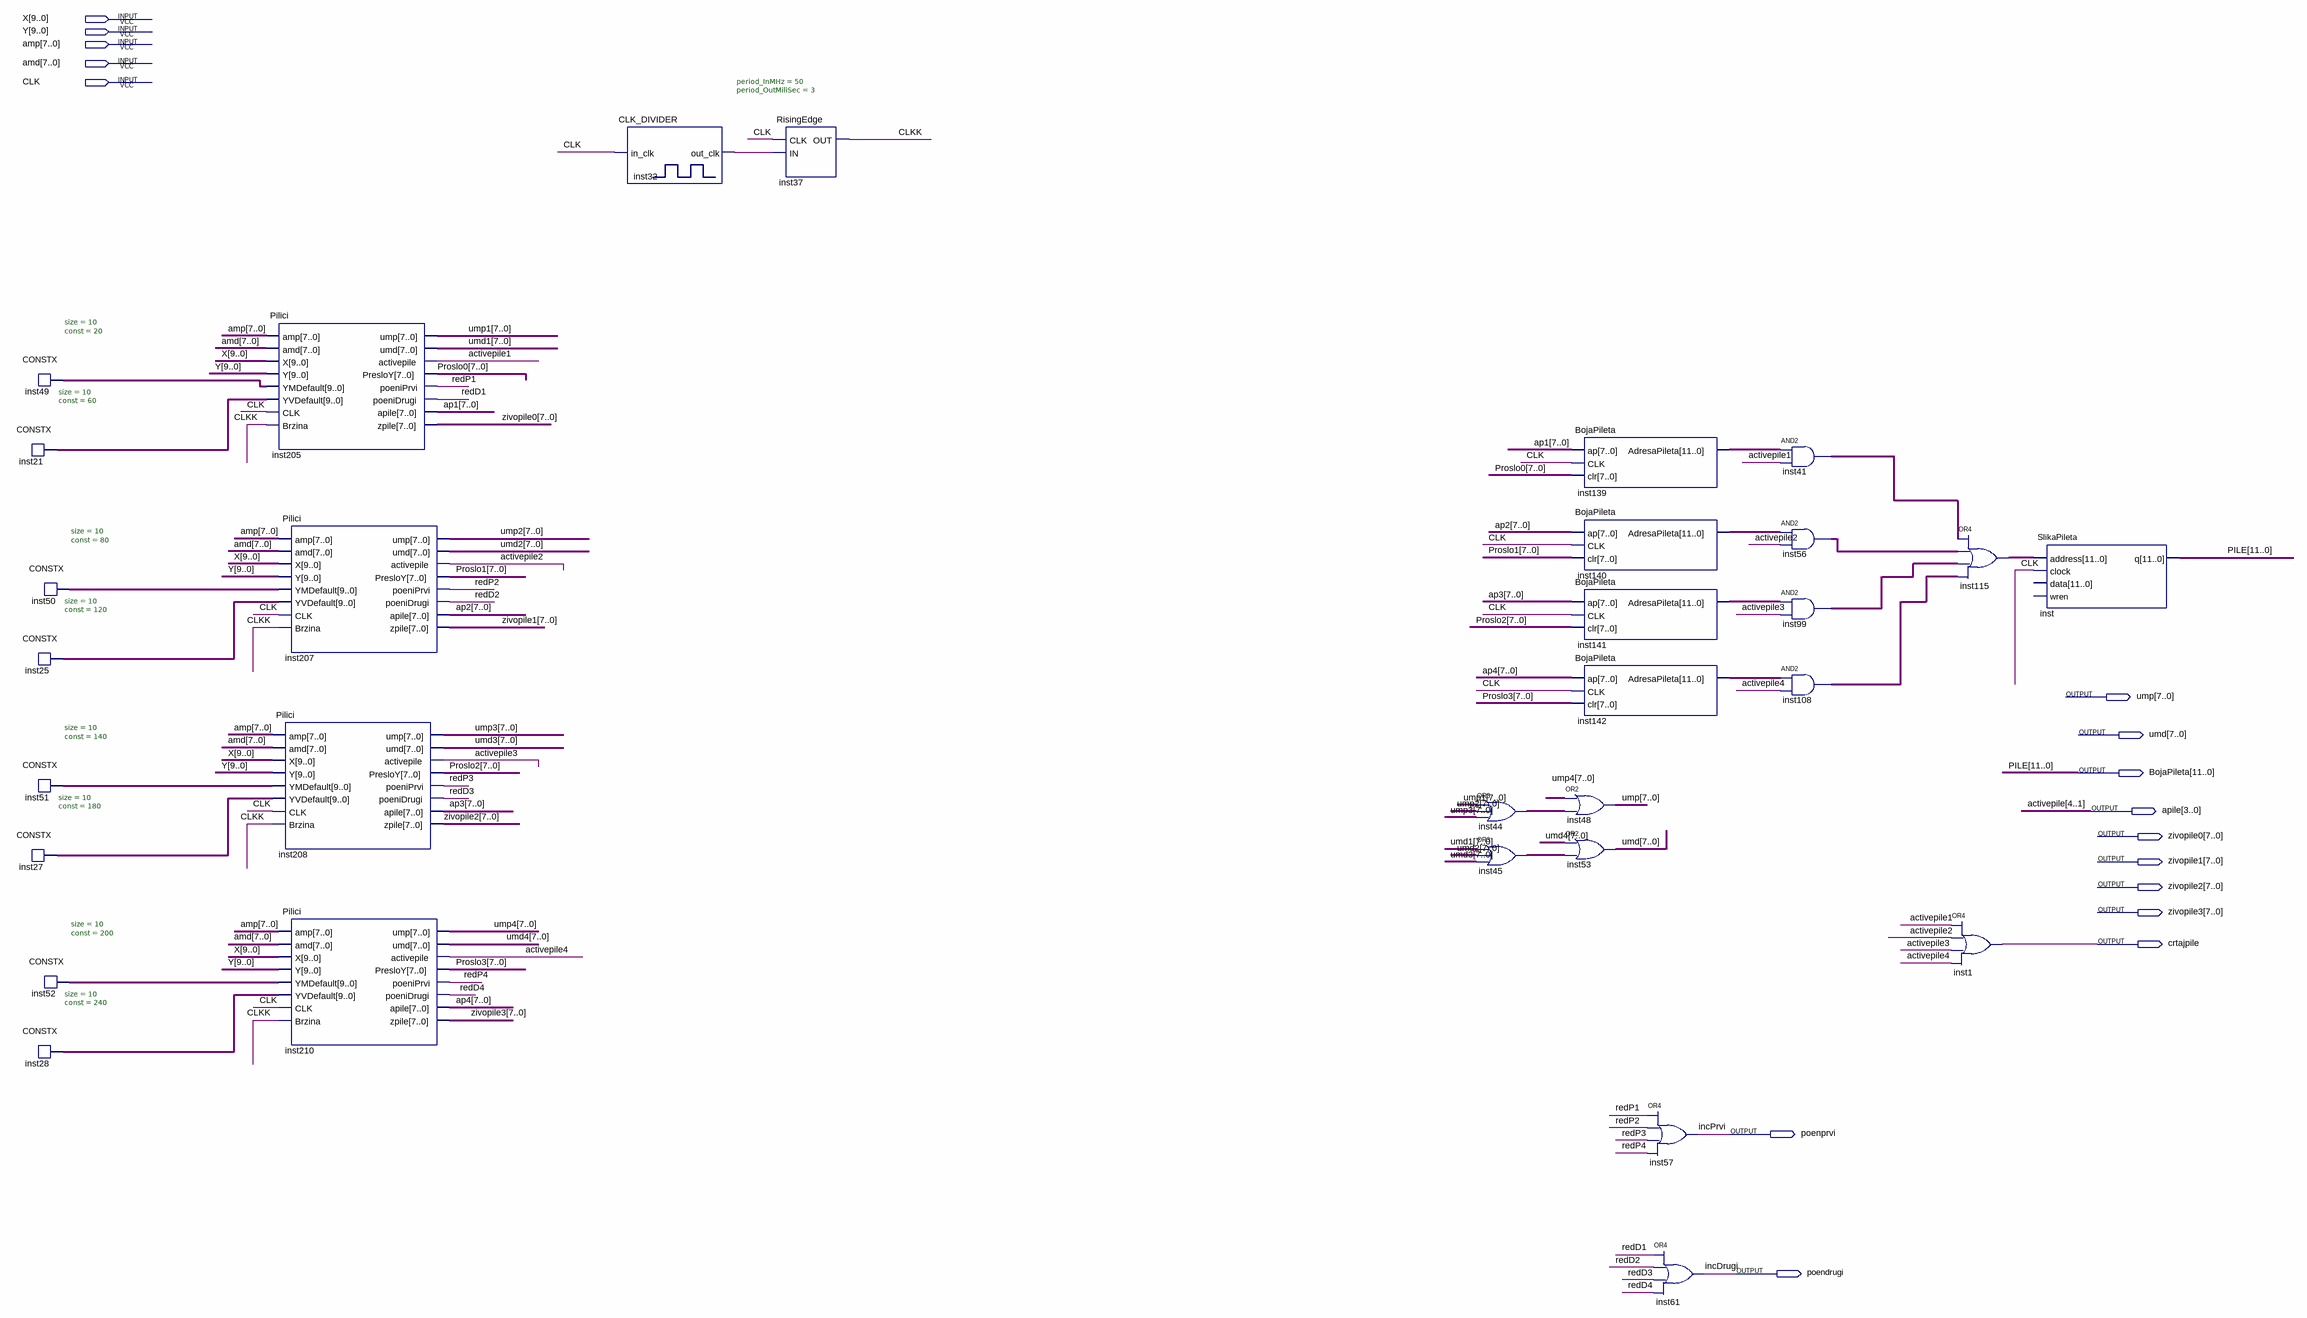
[diagram p0: schematic sheet]
// Quartus schematic Svi_Pilici.bdf as structural Verilog: 31 symbols, 16 pins
module Svi_Pilici (
  input  [9:0] X,
  input  [9:0] Y,
  input  [7:0] amp,
  input  [7:0] amd,
  input  CLK,
  output [7:0] ump,
  output [7:0] umd,
  output [11:0] BojaPileta,
  output [3:0] apile,
  output [7:0] zivopile0,
  output [7:0] zivopile1,
  output [7:0] zivopile2,
  output [7:0] zivopile3,
  output crtajpile,
  output poenprvi,
  output poendrugi
);

  wire CLKK, inst32_out_clk, redD1, redD2, redD3, redD4, redP1, redP2, redP3, redP4;
  wire [7:0] ap1, ap2, ap3, ap4, inst44_out, inst45_out, Proslo0, Proslo1, Proslo2, Proslo3, umd1, umd2,
       umd3, umd4, ump1, ump2, ump3, ump4;
  wire [9:0] inst21_data, inst25_data, inst27_data, inst28_data, inst49_data, inst50_data, inst51_data,
       inst52_data;
  wire [11:0] inst41_out, inst56_out, inst99_out, inst108_out, inst115_out, inst139_adresapileta,
       inst140_adresapileta, inst141_adresapileta, inst142_adresapileta;

  CONSTX #(.size(10), .\const (20)) inst49 (.data(inst49_data));
  CONSTX #(.size(10), .\const (60)) inst21 (.data(inst21_data));
  CONSTX #(.size(10), .\const (80)) inst50 (.data(inst50_data));
  CONSTX #(.size(10), .\const (120)) inst25 (.data(inst25_data));
  CONSTX #(.size(10), .\const (140)) inst51 (.data(inst51_data));
  CONSTX #(.size(10), .\const (180)) inst27 (.data(inst27_data));
  CONSTX #(.size(10), .\const (200)) inst52 (.data(inst52_data));
  CONSTX #(.size(10), .\const (240)) inst28 (.data(inst28_data));
  Pilici inst205 (
    .amp(amp), .amd(amd), .X(X), .Y(Y), .YMDefault(inst49_data), .YVDefault(inst21_data), .CLK(CLK),
    .Brzina(CLKK), .ump(ump1), .umd(umd1), .activepile(apile[0]), .PresloY(Proslo0), .poeniPrvi(redP1),
    .poeniDrugi(redD1), .apile(ap1), .zpile(zivopile0));
  Pilici inst207 (
    .amp(amp), .amd(amd), .X(X), .Y(Y), .YMDefault(inst50_data), .YVDefault(inst25_data), .CLK(CLK),
    .Brzina(CLKK), .ump(ump2), .umd(umd2), .activepile(apile[1]), .PresloY(Proslo1), .poeniPrvi(redP2),
    .poeniDrugi(redD2), .apile(ap2), .zpile(zivopile1));
  Pilici inst208 (
    .amp(amp), .amd(amd), .X(X), .Y(Y), .YMDefault(inst51_data), .YVDefault(inst27_data), .CLK(CLK),
    .Brzina(CLKK), .ump(ump3), .umd(umd3), .activepile(apile[2]), .PresloY(Proslo2), .poeniPrvi(redP3),
    .poeniDrugi(redD3), .apile(ap3), .zpile(zivopile2));
  Pilici inst210 (
    .amp(amp), .amd(amd), .X(X), .Y(Y), .YMDefault(inst52_data), .YVDefault(inst28_data), .CLK(CLK),
    .Brzina(CLKK), .ump(ump4), .umd(umd4), .activepile(apile[3]), .PresloY(Proslo3), .poeniPrvi(redP4),
    .poeniDrugi(redD4), .apile(ap4), .zpile(zivopile3));
  CLK_DIVIDER #(.period_InMHz(50), .period_OutMiliSec(3)) inst32 (.in_clk(CLK), .out_clk(inst32_out_clk));
  RisingEdge inst37 (.CLK(CLK), .IN(inst32_out_clk), .OUT(CLKK));
  assign inst44_out = ump1 | ump2 | ump3;  // OR3 inst44, 8 bits wide
  assign inst45_out = umd1 | umd2 | umd3;  // OR3 inst45, 8 bits wide
  BojaPileta inst139 (.ap(ap1), .CLK(CLK), .clr(Proslo0), .AdresaPileta(inst139_adresapileta));
  BojaPileta inst140 (.ap(ap2), .CLK(CLK), .clr(Proslo1), .AdresaPileta(inst140_adresapileta));
  BojaPileta inst141 (.ap(ap3), .CLK(CLK), .clr(Proslo2), .AdresaPileta(inst141_adresapileta));
  BojaPileta inst142 (.ap(ap4), .CLK(CLK), .clr(Proslo3), .AdresaPileta(inst142_adresapileta));
  assign ump = ump4 | inst44_out;  // OR2 inst48, 8 bits wide
  assign umd = umd4 | inst45_out;  // OR2 inst53, 8 bits wide
  or inst57 (poenprvi, redP1, redP2, redP3, redP4);
  or inst61 (poendrugi, redD1, redD2, redD3, redD4);
  assign inst41_out = inst139_adresapileta & {12{apile[0]}};  // AND2 inst41, 12 bits wide
  assign inst56_out = inst140_adresapileta & {12{apile[1]}};  // AND2 inst56, 12 bits wide
  assign inst99_out = inst141_adresapileta & {12{apile[2]}};  // AND2 inst99, 12 bits wide
  assign inst108_out = inst142_adresapileta & {12{apile[3]}};  // AND2 inst108, 12 bits wide
  assign inst115_out = inst41_out | inst56_out | inst99_out | inst108_out;  // OR4 inst115, 12 bits wide
  or inst1 (crtajpile, apile[0], apile[1], apile[2], apile[3]);
  SlikaPileta inst (.address(inst115_out), .clock(CLK), .q(BojaPileta));  // open: data, wren

  // Other names for the same wires on the sheet: activepile[4:1] = apile; activepile1 = apile[0];
  //   activepile2 = apile[1]; activepile3 = apile[2]; activepile4 = apile[3]; incDrugi = poendrugi;
  //   incPrvi = poenprvi; PILE[11:0] = BojaPileta
endmodule
